# EAGLE design lab2h (EAGLE 9.6.2)
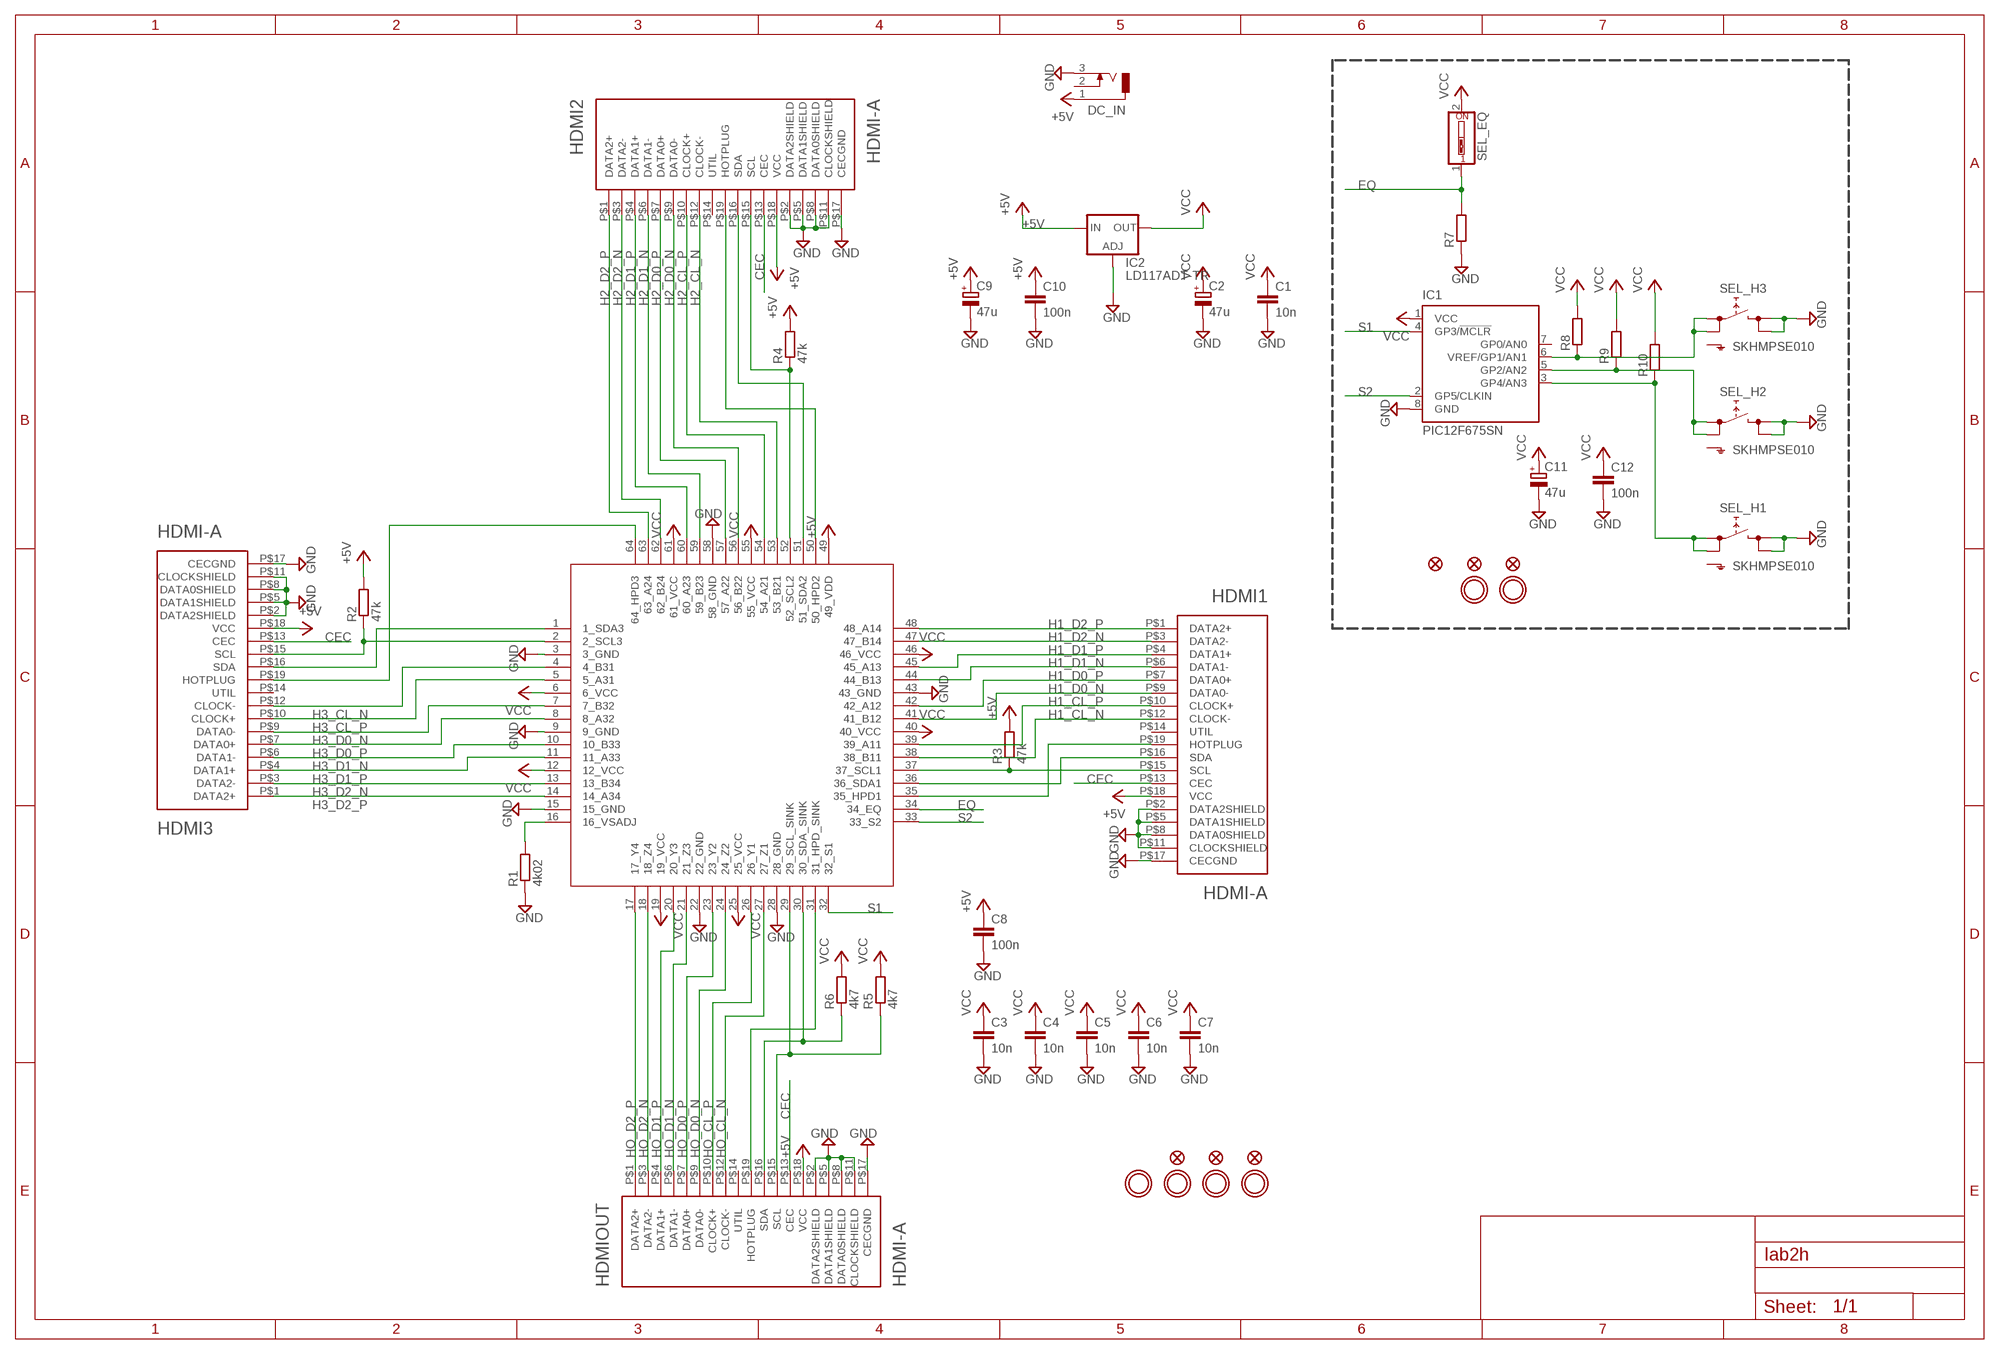
[diagram p0: schematic, sheet 1]

## Parts
C1  10n  C-EUC0402  [C0402]
C2  47u  CPOL-EUSMCA  [SMC_A]
C3  10n  C0402  [0402]
C4  10n  C0402  [0402]
C5  10n  C0402  [0402]
C6  10n  C0402  [0402]
C7  10n  C0402  [0402]
C8  100n  C0402  [0402]
C9  47u  CPOL-EUSMCA  [SMC_A]
C10  100n  C-EUC0402  [C0402]
C11  47u  CPOL-EUSMCA  [SMC_A]
C12  100n  C-EUC0402  [C0402]
DC_IN  DCJ0303  [DCJ0303]
FID1  FIDUCIAL""  [FIDUCIAL_1MM]
FID2  FIDUCIAL""  [FIDUCIAL_1MM]
FID3  FIDUCIAL""  [FIDUCIAL_1MM]
FID4  FIDUCIAL""  [FIDUCIAL_1MM]
FID5  FIDUCIAL""  [FIDUCIAL_1MM]
FID6  FIDUCIAL""  [FIDUCIAL_1MM]
HDMI1  HDMI-A  [HDMI_A]
HDMI2  HDMI-A  [HDMI_A]
HDMI3  HDMI-A  [HDMI_A]
HDMIOUT  HDMI-A  [HDMI_A]
IC1  PIC12F675SN  [SO-08]
IC2  LD117ADT-TR  [DPACK]
R1  4k02  R0402  [0402]
R2  47k  R0402  [0402]
R3  47k  R0402  [0402]
R4  47k  R0402  [0402]
R5  4k7  R0402  [0402]
R6  4k7  R0402  [0402]
R7  R-EU_R0805  [R0805]
R8  R-EU_R0805  [R0805]
R9  R-EU_R0805  [R0805]
R10  R-EU_R0805  [R0805]
SEL_EQ  SW_DIP-1  [EDG-01]
SEL_H1  SKHMPSE010  [SKHMPXE010]
SEL_H2  SKHMPSE010  [SKHMPXE010]
SEL_H3  SKHMPSE010  [SKHMPXE010]
U1  TMDS351TQFP64  [QFP50P1200X1200X120-64]
U$1  MOUNTINGHOLE3.0  [MOUNTINGHOLE_3.0_PLATED]
U$2  MOUNTINGHOLE3.0  [MOUNTINGHOLE_3.0_PLATED]
U$31  MOUNTINGHOLE3.0  [MOUNTINGHOLE_3.0_PLATED]
U$32  MOUNTINGHOLE3.0  [MOUNTINGHOLE_3.0_PLATED]
U$33  MOUNTINGHOLE3.0  [MOUNTINGHOLE_3.0_PLATED]
U$34  MOUNTINGHOLE3.0  [MOUNTINGHOLE_3.0_PLATED]

## Nets
+5V: C8.1 C9.+ C10.1 DC_IN.1 HDMI1.P$18(VCC) HDMI2.P$18(VCC) HDMI3.P$18(VCC) HDMIOUT.P$18(VCC) IC2.3(IN) R2.2 R3.2 R4.2 U1.49(49_VDD)
CEC: HDMI1.P$13(CEC) HDMI2.P$13(CEC) HDMI3.P$13(CEC) HDMIOUT.P$13(CEC)
EQ: R7.2 SEL_EQ.1 U1.34(34_EQ)
GND: C1.2 C2.- C3.2 C4.2 C5.2 C6.2 C7.2 C8.2 C9.- C10.2 C11.- C12.2 DC_IN.3 HDMI1.P$2(DATA2SHIELD) HDMI1.P$5(DATA1SHIELD) HDMI1.P$8(DATA0SHIELD) HDMI1.P$11(CLOCKSHIELD) HDMI1.P$17(CECGND) HDMI2.P$2(DATA2SHIELD) HDMI2.P$5(DATA1SHIELD) HDMI2.P$8(DATA0SHIELD) HDMI2.P$11(CLOCKSHIELD) HDMI2.P$17(CECGND) HDMI3.P$2(DATA2SHIELD) HDMI3.P$5(DATA1SHIELD) HDMI3.P$8(DATA0SHIELD) HDMI3.P$11(CLOCKSHIELD) HDMI3.P$17(CECGND) HDMIOUT.P$2(DATA2SHIELD) HDMIOUT.P$5(DATA1SHIELD) HDMIOUT.P$8(DATA0SHIELD) HDMIOUT.P$11(CLOCKSHIELD) HDMIOUT.P$17(CECGND) IC1.8(GND) IC2.1(ADJ) R1.1 R7.1 SEL_H1.3(2.1) SEL_H1.4(2.2) SEL_H2.3(2.1) SEL_H2.4(2.2) SEL_H3.3(2.1) SEL_H3.4(2.2) U1.3(3_GND) U1.9(9_GND) U1.15(15_GND) U1.22(22_GND) U1.28(28_GND) U1.43(43_GND) U1.58(58_GND)
H1_CL_N: HDMI1.P$12(CLOCK-) U1.38(38_B11)
H1_CL_P: HDMI1.P$10(CLOCK+) U1.39(39_A11)
H1_D0_N: HDMI1.P$9(DATA0-) U1.41(41_B12)
H1_D0_P: HDMI1.P$7(DATA0+) U1.42(42_A12)
H1_D1_N: HDMI1.P$6(DATA1-) U1.44(44_B13)
H1_D1_P: HDMI1.P$4(DATA1+) U1.45(45_A13)
H1_D2_N: HDMI1.P$3(DATA2-) U1.47(47_B14)
H1_D2_P: HDMI1.P$1(DATA2+) U1.48(48_A14)
H2_CL_N [100Ohm diff pair]: HDMI2.P$12(CLOCK-) U1.53(53_B21)
H2_CL_P [100Ohm diff pair]: HDMI2.P$10(CLOCK+) U1.54(54_A21)
H2_D0_N [100Ohm diff pair]: HDMI2.P$9(DATA0-) U1.56(56_B22)
H2_D0_P [100Ohm diff pair]: HDMI2.P$7(DATA0+) U1.57(57_A22)
H2_D1_N [100Ohm diff pair]: HDMI2.P$6(DATA1-) U1.59(59_B23)
H2_D1_P [100Ohm diff pair]: HDMI2.P$4(DATA1+) U1.60(60_A23)
H2_D2_N [100Ohm diff pair]: HDMI2.P$3(DATA2-) U1.62(62_B24)
H2_D2_P [100Ohm diff pair]: HDMI2.P$1(DATA2+) U1.63(63_A24)
H3_CL_N: HDMI3.P$12(CLOCK-) U1.4(4_B31)
H3_CL_P: HDMI3.P$10(CLOCK+) U1.5(5_A31)
H3_D0_N: HDMI3.P$9(DATA0-) U1.7(7_B32)
H3_D0_P: HDMI3.P$7(DATA0+) U1.8(8_A32)
H3_D1_N: HDMI3.P$6(DATA1-) U1.10(10_B33)
H3_D1_P: HDMI3.P$4(DATA1+) U1.11(11_A33)
H3_D2_N: HDMI3.P$3(DATA2-) U1.13(13_B34)
H3_D2_P: HDMI3.P$1(DATA2+) U1.14(14_A34)
HO_CL_N: HDMIOUT.P$12(CLOCK-) U1.27(27_Z1)
HO_CL_P: HDMIOUT.P$10(CLOCK+) U1.26(26_Y1)
HO_D0_N: HDMIOUT.P$9(DATA0-) U1.24(24_Z2)
HO_D0_P: HDMIOUT.P$7(DATA0+) U1.23(23_Y2)
HO_D1_N: HDMIOUT.P$6(DATA1-) U1.21(21_Z3)
HO_D1_P: HDMIOUT.P$4(DATA1+) U1.20(20_Y3)
HO_D2_N: HDMIOUT.P$3(DATA2-) U1.18(18_Z4)
HO_D2_P: HDMIOUT.P$1(DATA2+) U1.17(17_Y4)
N$25: HDMI3.P$19(HOTPLUG) U1.64(64_HPD3)
N$26: HDMI2.P$19(HOTPLUG) U1.50(50_HPD2)
N$27: HDMI1.P$19(HOTPLUG) U1.35(35_HPD1)
N$36: HDMIOUT.P$19(HOTPLUG) U1.31(31_HPD_SINK)
N$37: HDMI3.P$16(SDA) U1.1(1_SDA3)
N$38: HDMI3.P$15(SCL) R2.1 U1.2(2_SCL3)
N$39: HDMI2.P$16(SDA) U1.51(51_SDA2)
N$40: HDMI2.P$15(SCL) R4.1 U1.52(52_SCL2)
N$41: HDMI1.P$15(SCL) R3.1 U1.37(37_SCL1)
N$42: HDMI1.P$16(SDA) U1.36(36_SDA1)
N$43: HDMIOUT.P$16(SDA) R6.1 U1.30(30_SDA_SINK)
N$44: HDMIOUT.P$15(SCL) R5.1 U1.29(29_SCL_SINK)
N$45: R1.2 U1.16(16_VSADJ)
N$50: IC1.6(VREF/GP1/AN1) R8.1 SEL_H3.1(1.1) SEL_H3.2(1.2)
N$51: IC1.5(GP2/AN2) R9.1 SEL_H2.1(1.1) SEL_H2.2(1.2)
N$52: IC1.3(GP4/AN3) R10.1 SEL_H1.1(1.1) SEL_H1.2(1.2)
S1: IC1.4(GP3/!MCLR) U1.32(32_S1)
S2: IC1.2(GP5/CLKIN) U1.33(33_S2)
VCC: C1.1 C2.+ C3.1 C4.1 C5.1 C6.1 C7.1 C11.+ C12.1 IC1.1(VCC) IC2.4(OUT) R5.2 R6.2 R8.2 R9.2 R10.2 SEL_EQ.2 U1.6(6_VCC) U1.12(12_VCC) U1.19(19_VCC) U1.25(25_VCC) U1.40(40_VCC) U1.46(46_VCC) U1.55(55_VCC) U1.61(61_VCC)
Unconnected: DC_IN.2 HDMI1.P$14(UTIL) HDMI2.P$14(UTIL) HDMI3.P$14(UTIL) HDMIOUT.P$14(UTIL) IC1.7(GP0/AN0) SEL_H1.5(SH) SEL_H2.5(SH) SEL_H3.5(SH)

## Library data of the parts
C1 C10 C12 = rcl:C-EU: CAPACITOR, European symbol; SPICEPREFIX: C
C2 C9 C11 = rcl:CPOL-EU: POLARIZED CAPACITOR, European symbol; SPICEPREFIX: C
C3-C8 = labHDE_rev3:C0402
DC_IN = con-jack:DCJ0303: DC POWER JACK Source: DCJ0303.pdf; OC_FARNELL: unknown; OC_NEWARK: unknown
FID1-FID6 = microbuilder:FIDUCIAL: Fiducial Alignment Points Various fiducial points for machine vision alignment.; BOM: EXCLUDE
HDMI1-HDMI3 HDMIOUT = labHDE_rev3:HDMI-A: Horizonal HDMI type "A" jack
IC1 = microchip:PIC12F675: 8-Pin FLASH-Based 8-Bit CMOS Microcontroller Precision Internal 4 MHz oscillator factory calibrated to ±1% Low Power Features: Standby Current: - 1 nA @ 2.0V, typical Operating Current: - 8.5µA @ 32 kHz, 2.0V, typical - 100µA @ 1 MHz, 2.0V, typical Watchdog Timer Current: - 300 nA @ 2.0V, typical Timer1 oscillator current: - 4µA @ 32 kHz, 2.0V, typical Analog-to-Digital Converter module: - 10-bit resolution - Programmable 4-channel input - Voltage reference input Source: http://www.microchip.com .. 41190E.pdf; MF: MICROCHIP; MPN: PIC12F675-E/SN; OC_FARNELL: 9759026; OC_NEWARK: 92C4341
IC2 = v-reg:LD117A?*: Low drop fixed and adjustable positive voltage regulators 1 A Source: http://www.st.com/stonline/products/literature/ds/7194/ld1117axx.pdf
R1-R6 = labHDE_rev3:R0402
R7-R10 = rcl:R-EU_: RESISTOR, European symbol; SPICEPREFIX: R
SEL_EQ = special:SW_DIP-1: DIP SWITCH
SEL_H1-SEL_H3 = switch:SKHMP*E010: 6.2 X 6.5mm TACT Switch (SMD) Source: http://www3.alps.co.jp/WebObjects/catalog.woa/PDF/E/Switch/Tact/SKHM/SKHM.PDF
U1 = labHDE_rev3:TMDS351
U$1 U$2 U$31-U$34 = microbuilder:MOUNTINGHOLE: Mounting Hole For #2 screws (0.086"/2.18mm width, 0.094"/2.4mm hole) use 2.5mm; BOM: EXCLUDE

## Net classes
1 100Ohm diff pair: width 0.257 mm, clearance 0.15 mm

## Board
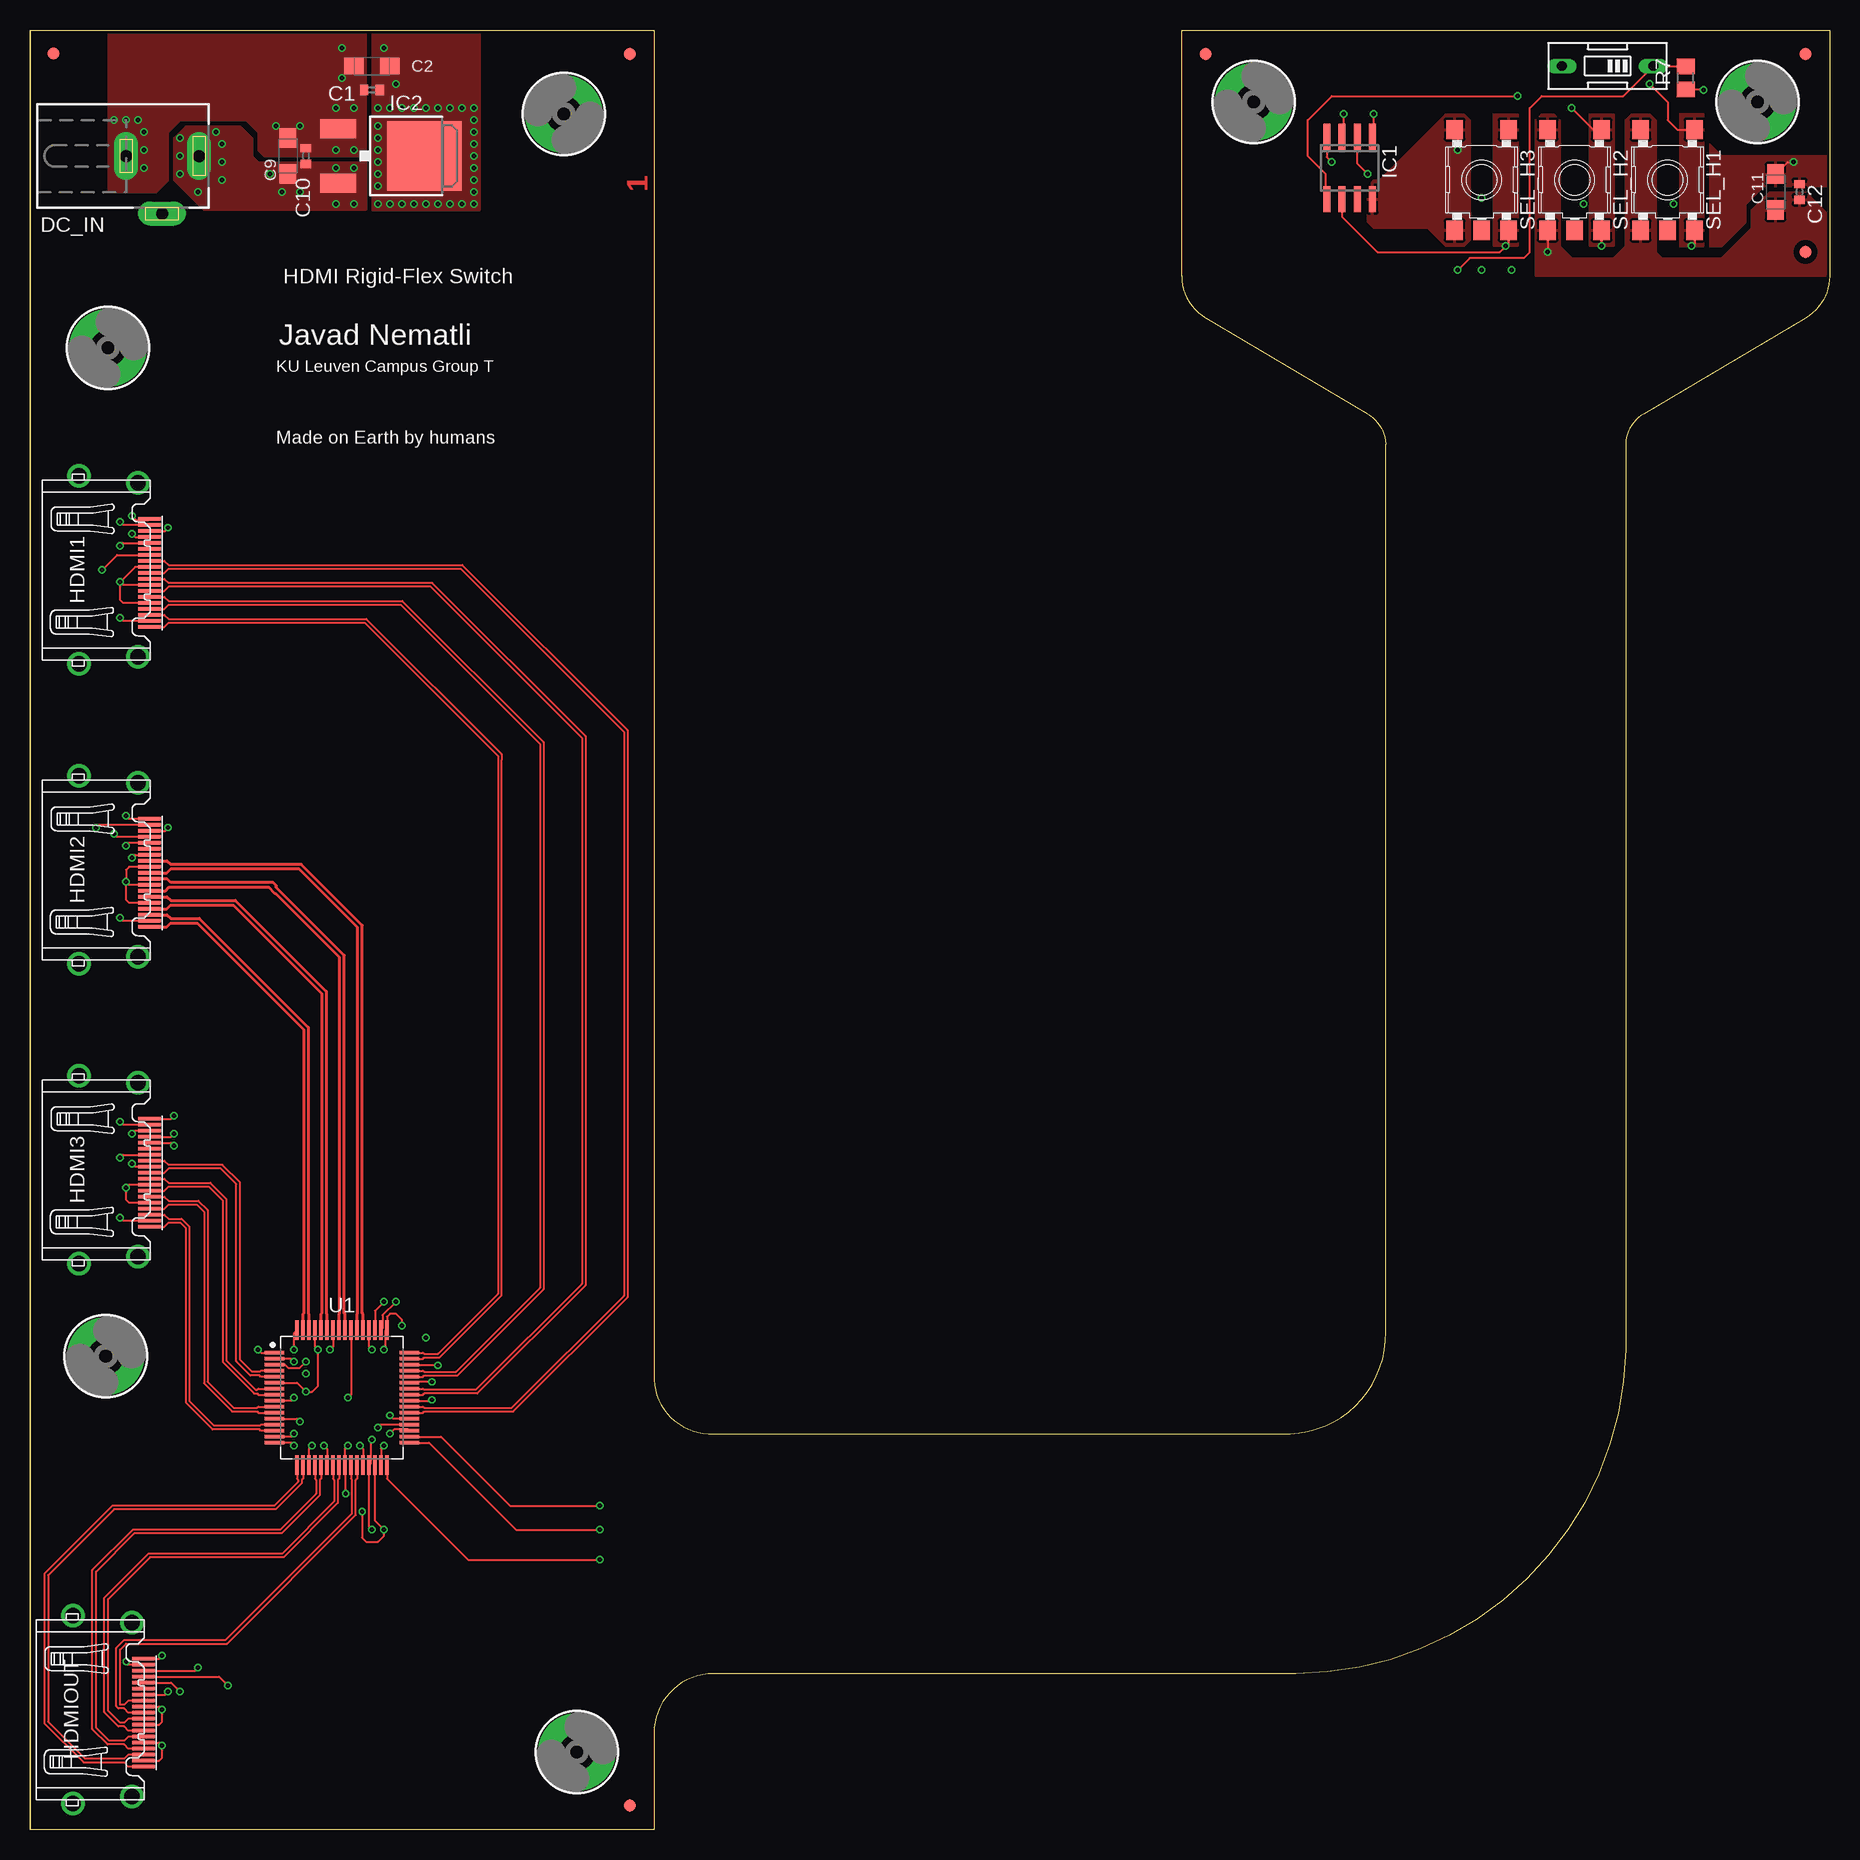
[diagram p1: board, top side]
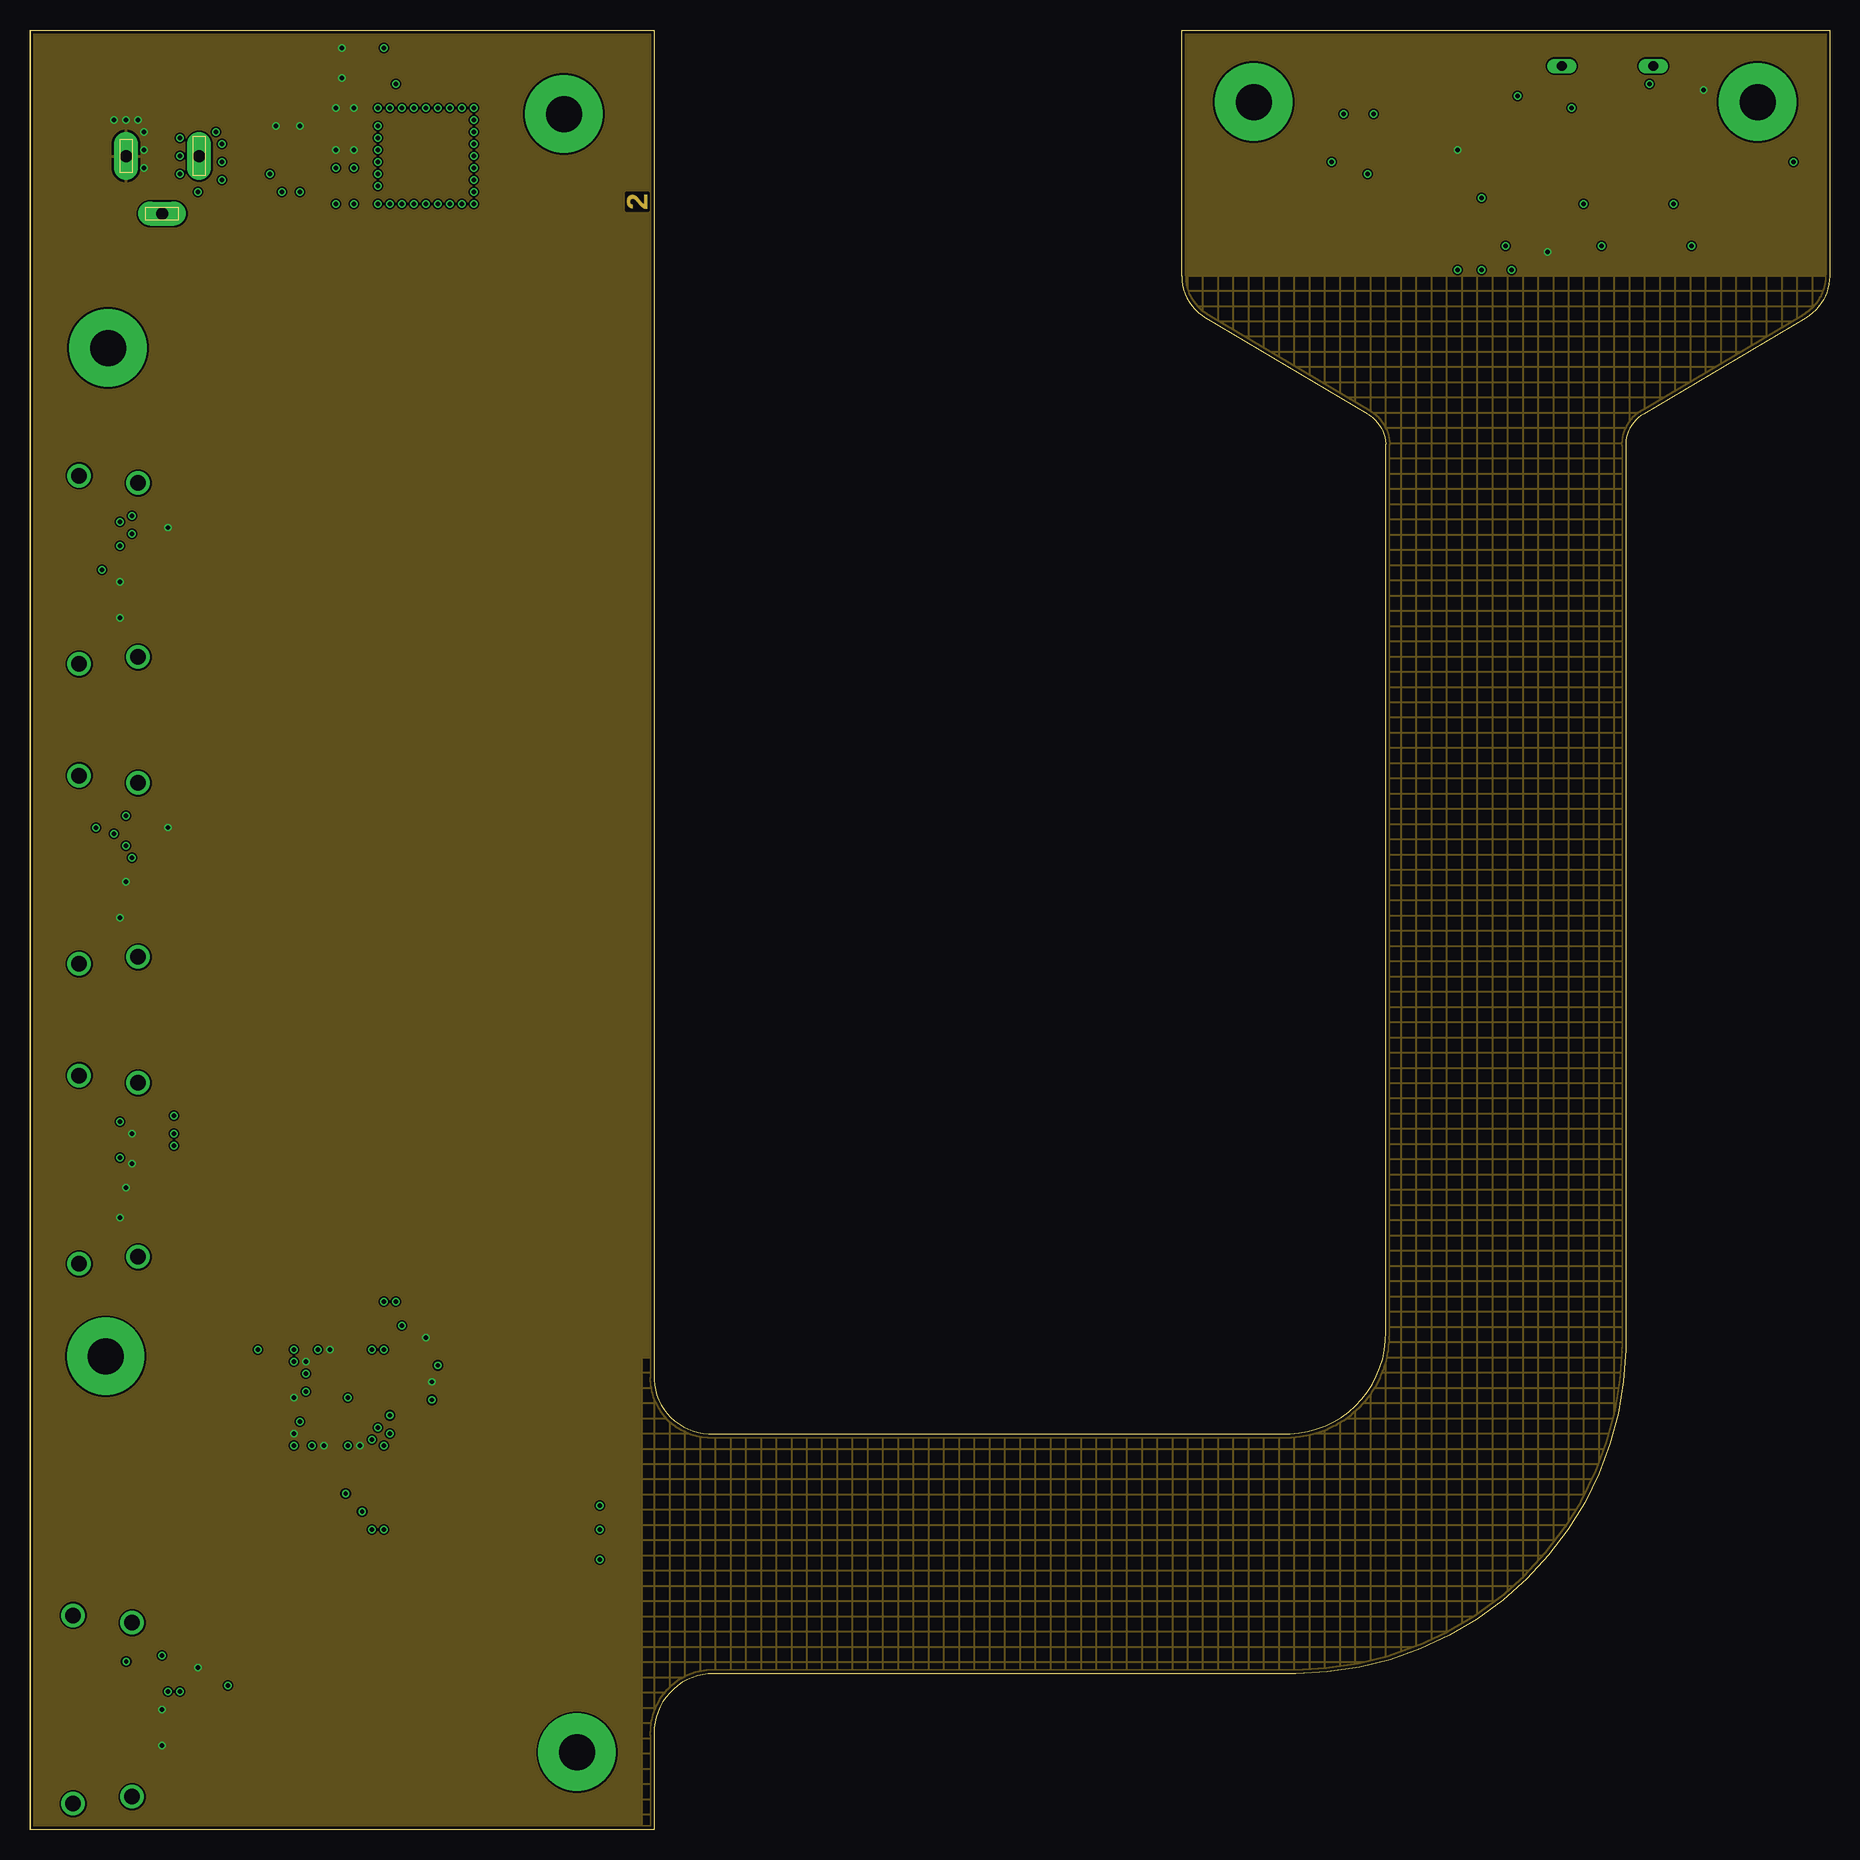
[diagram p2: board, inner layer Flex1]
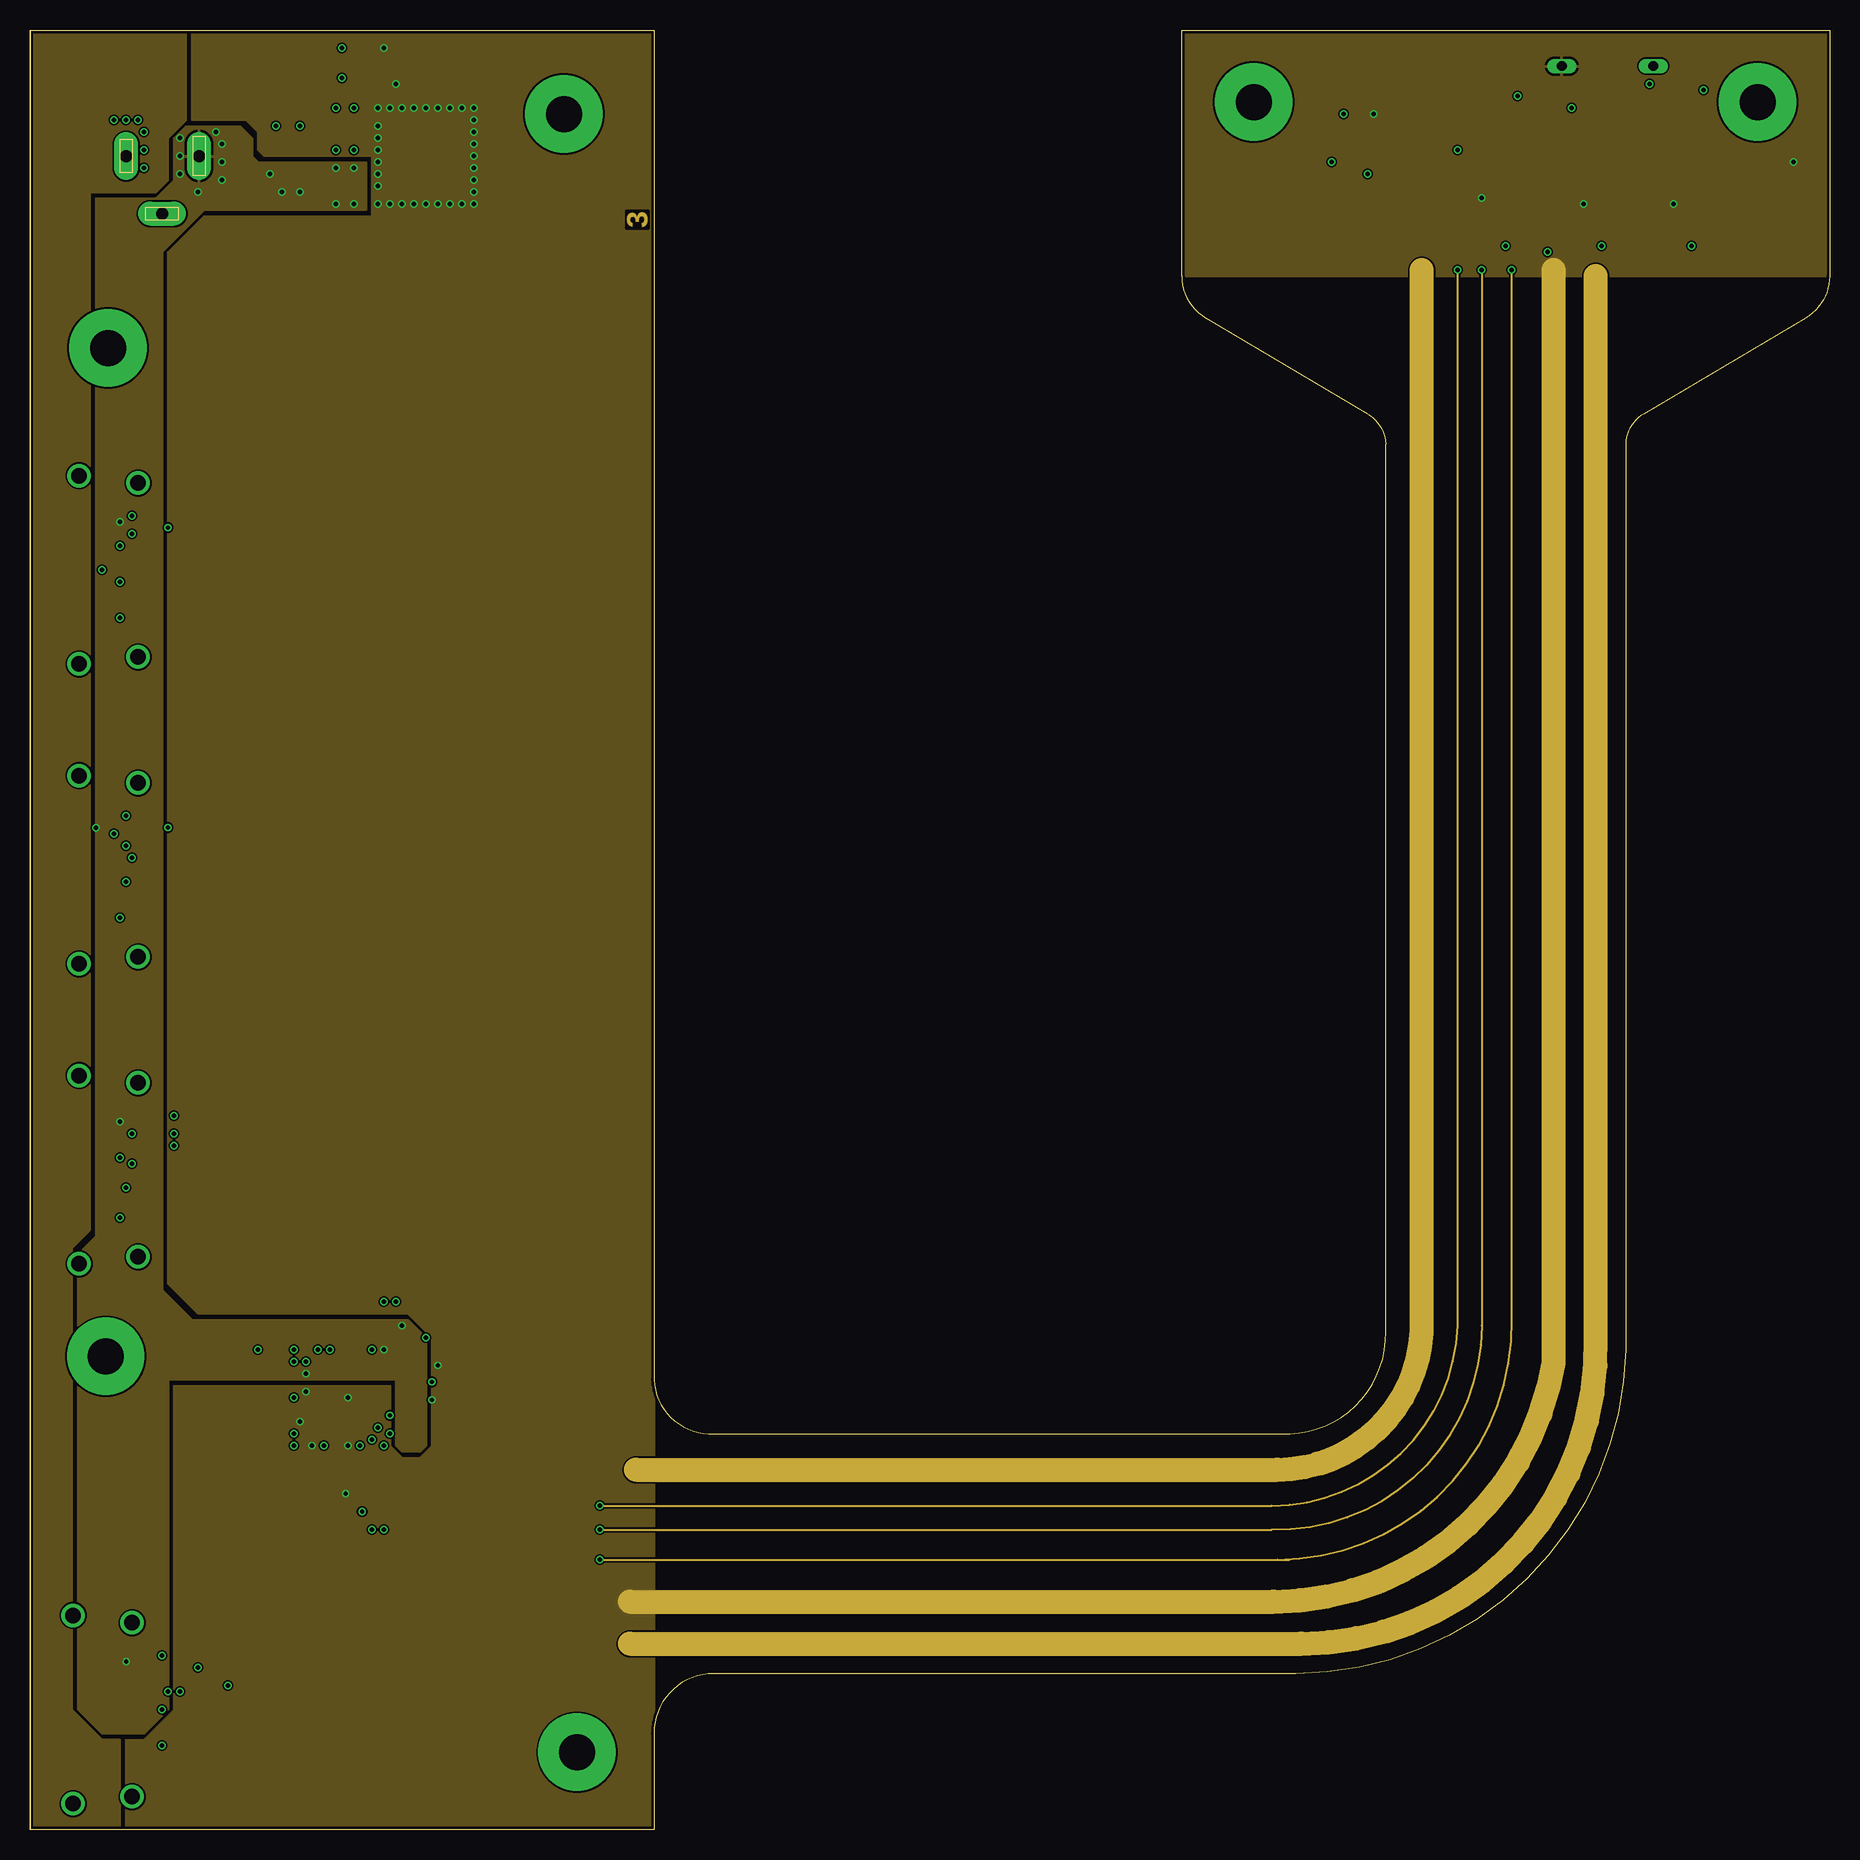
[diagram p3: board, inner layer Flex2]
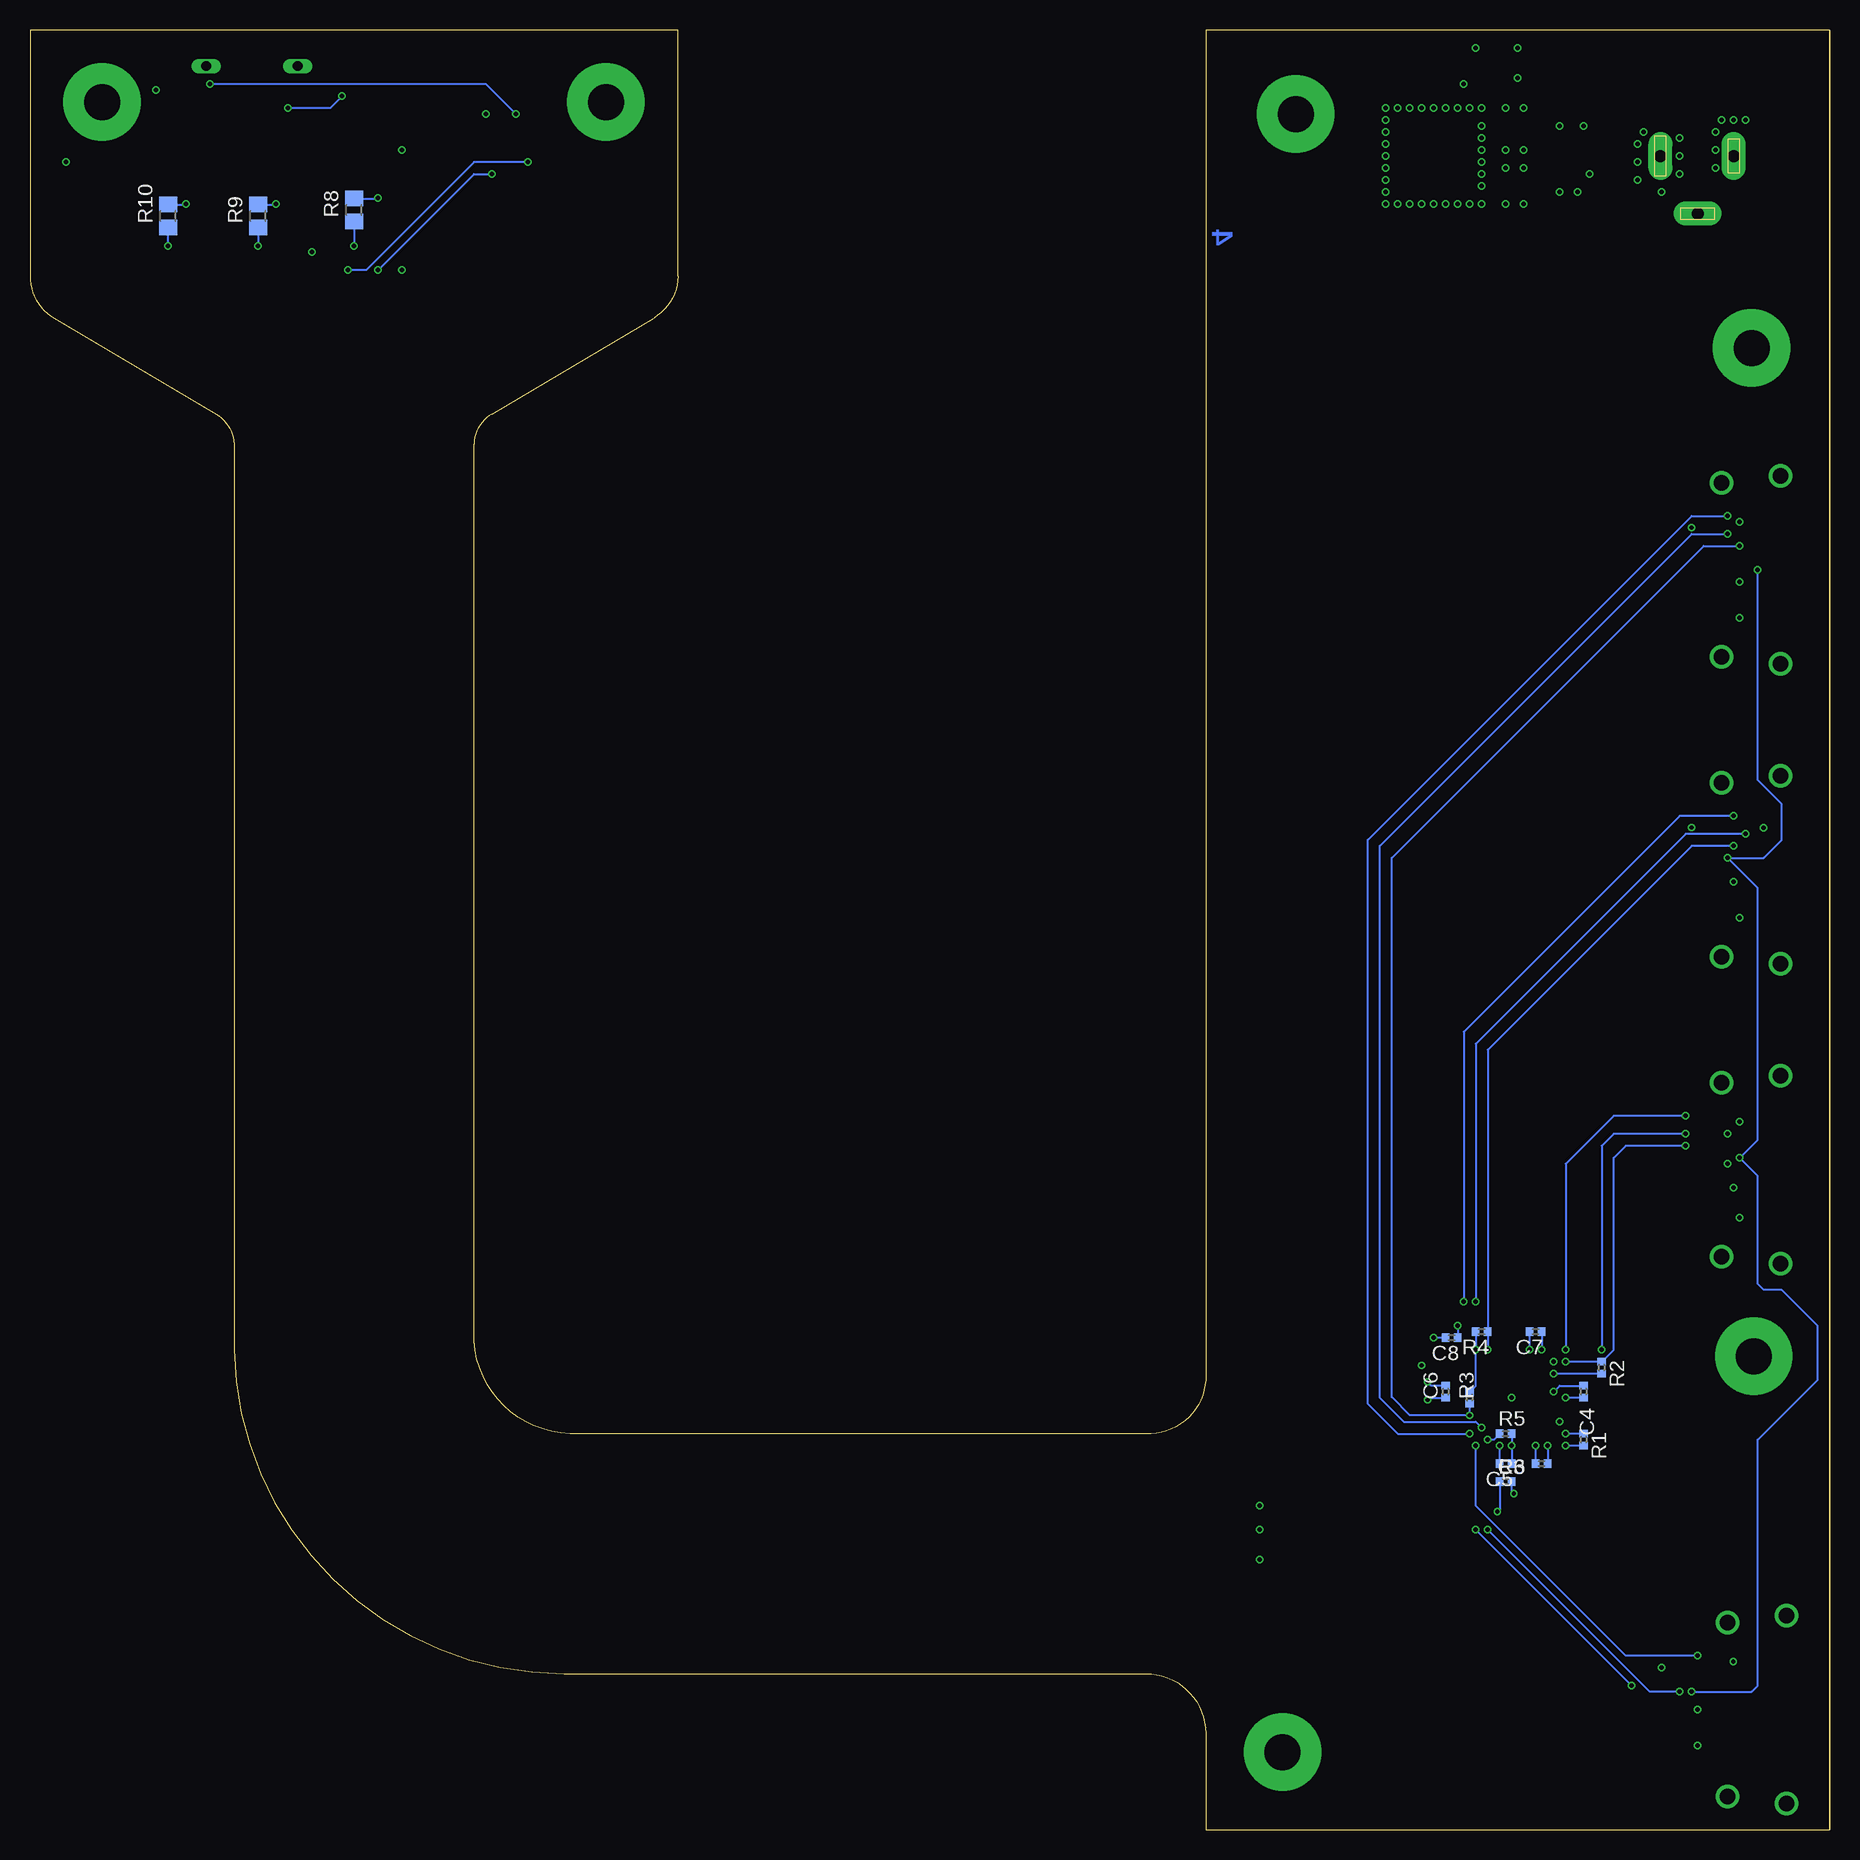
[diagram p4: board, bottom side, seen from below]

Size 150 x 150 mm. Coordinates in mm from the lower left corner, seen from the top.
Outline: 0,0 0,150 52,150 52,37.5 arc90 57,33 105,33 arc90 113,41.5 113,115.5 arc57 111.5,118 98,126 arc-59 96,129.5 96,150 150,150 150,129.5 arc-60 148,126 134.5,118 arc57 133,115.5 133,40 arc-89 105.5,13 57,13 arc90 52,8 52,0 0,0
Copper layers (1+2*15+16): Top 0.03mm / dielectric 0.285mm / Flex1 0.017mm / dielectric 0.05mm / Flex2 0.017mm / dielectric 0.285mm / Bottom 0.03mm
Design rules "4Layer_PClass6 *": minimum track width 0.15mm, minimum drill 0.35mm, track to track 0.15mm, track to pad 0.15mm, pad to pad 0.15mm, via to via 0.15mm, smd to smd 0mil, copper to edge 0.25mm, drill to drill 0.35mm, minimum pad ring 0.175mm, minimum via ring 0.125mm, stop-mask expansion 0mil, vias tented up to drill 0.45mm, thermal gap 0.2mm
Milling: 1 lines

### Footprints (pad centres in the part's own frame; a part is rotated, then mirrored left to right if it is on the bottom)
C0402 = smd 0.7 x 0.9: 1 -0.65,0; 2 0.65,0
SMC_A = smd 1.6 x 1.4: + -1.5,0; - 1.5,0
0402 = smd 0.6 x 0.7: 1 -0.5,0; 2 0.5,0
DCJ0303 = drill 1 pad 2 long: 1 0,3.1; 2 4.8,0; 3 0,-3
FIDUCIAL_1MM = smd 1 x 1: 1 0,0
HDMI_A = smd 0.3 x 1.9: P$1 4.75,3.95; P$2 4.25,3.95; P$3 3.75,3.95; P$4 3.25,3.95; P$5 2.75,3.95; P$6 2.25,3.95; P$7 1.75,3.95; P$8 1.25,3.95; P$9 0.75,3.95; P$10 0.25,3.95; P$11 -0.25,3.95; P$12 -0.75,3.95; P$13 -1.25,3.95; P$14 -1.75,3.95; P$15 -2.25,3.95; P$16 -2.75,3.95; P$17 -3.25,3.95; P$18 -3.75,3.95; P$19 -4.25,3.95 | drill 1.3: P$20 -7.25,3; P$21 7.25,3; P$22 7.85,-1.9; P$23 -7.85,-1.9
SO-08 = smd 0.6 x 2.2: 1 -1.905,-2.6; 2 -0.635,-2.6; 3 0.635,-2.6; 4 1.905,-2.6; 5 1.905,2.6; 6 0.635,2.6; 7 -0.635,2.6; 8 -1.905,2.6
DPACK = smd 1.6 x 3: 1 -2.28,-4.8; 3 2.28,-4.8 | smd 5.8 x 6.2: 4 0,2.38
R0805 = smd 1.3 x 1.5: 1 -0.95,0; 2 0.95,0
EDG-01 = drill 0.813 long: 1 0,-3.81; 2 0,3.81
SKHMPXE010 = smd 1.6 x 1.4: 1 -4.2,2.25; 2 4.2,2.25; 3 -4.2,-2.25; 4 4.2,-2.25; 5 4.2,0
QFP50P1200X1200X120-64 = smd 1.652 x 0.28: 1 -5.632,3.75; 2 -5.632,3.25; 3 -5.632,2.75; 4 -5.632,2.25; 5 -5.632,1.75; 6 -5.632,1.25; 7 -5.632,0.75; 8 -5.632,0.25; 9 -5.632,-0.25; 10 -5.632,-0.75; 11 -5.632,-1.25; 12 -5.632,-1.75; 13 -5.632,-2.25; 14 -5.632,-2.75; 15 -5.632,-3.25; 16 -5.632,-3.75; 33 5.632,-3.75; 34 5.632,-3.25; 35 5.632,-2.75; 36 5.632,-2.25; 37 5.632,-1.75; 38 5.632,-1.25; 39 5.632,-0.75; 40 5.632,-0.25; 41 5.632,0.25; 42 5.632,0.75; 43 5.632,1.25; 44 5.632,1.75; 45 5.632,2.25; 46 5.632,2.75; 47 5.632,3.25; 48 5.632,3.75 | smd 0.28 x 1.652: 17 -3.75,-5.632; 18 -3.25,-5.632; 19 -2.75,-5.632; 20 -2.25,-5.632; 21 -1.75,-5.632; 22 -1.25,-5.632; 23 -0.75,-5.632; 24 -0.25,-5.632; 25 0.25,-5.632; 26 0.75,-5.632; 27 1.25,-5.632; 28 1.75,-5.632; 29 2.25,-5.632; 30 2.75,-5.632; 31 3.25,-5.632; 32 3.75,-5.632; 49 3.75,5.632; 50 3.25,5.632; 51 2.75,5.632; 52 2.25,5.632; 53 1.75,5.632; 54 1.25,5.632; 55 0.75,5.632; 56 0.25,5.632; 57 -0.25,5.632; 58 -0.75,5.632; 59 -1.25,5.632; 60 -1.75,5.632; 61 -2.25,5.632; 62 -2.75,5.632; 63 -3.25,5.632; 64 -3.75,5.632
MOUNTINGHOLE_3.0_PLATED = drill 3 pad 6.452: P$1 0,0

### Placement (x,y rotation side)
C1  28.5,145 180 top
C2  28.5,147 180 top
C3  24,30.5 180 bottom
C4  20.5,36.5 270 bottom
C5  27,30.5 180 bottom
C6  32,36.5 90 bottom
C7  24.5,41.5 180 bottom
C8  31.5,41 180 bottom
C9  21.5,139.5 90 top
C10  23,139.5 90 top
C11  145.5,136.5 270 top
C12  147.5,136.5 270 top
DC_IN  11,139.5 270 top
FID1  1.94,148.04 0 top
FID2  50,2 0 top
FID3  50,148 0 top
FID4  98,148 0 top
FID5  148,148 0 top
FID6  148,131.5 0 top
HDMI1  6,105 270 top
HDMI2  6,80 270 top
HDMI3  6,55 270 top
HDMIOUT  5.5,10 270 top
IC1  110,138.5 180 top
IC2  30.5,139.5 270 top
R1  20.5,32.5 270 bottom
R2  19,38.5 270 bottom
R3  30,36 90 bottom
R4  29,41.5 180 bottom
R5  27,33 0 bottom
R6  27,29 0 bottom
R7  138,146 90 top
R8  123,135 90 bottom
R9  131,134.5 90 bottom
R10  138.5,134.5 90 bottom
SEL_EQ  131.5,147 90 top
SEL_H1  136.5,137.5 270 top
SEL_H2  128.75,137.5 270 top
SEL_H3  121,137.5 270 top
U1  26,36 0 top
U$1  144,144 0 top
U$2  45.59,6.45 0 top
U$31  102,144 0 top
U$32  6.31,39.45 0 top
U$33  6.5,123.5 0 top
U$34  44.5,143 90 top

### Tracks (layer width: path | path; a pad name or v marks a point on that pad's centre or on a via)
+5V  (via drill 0.35)
  Top 0.15: 29.62,41.57 29.62,41.5
  Top 0.152: v29.5,40 29.62,40.12 29.62,41.5 U1.49 29.75,42.75 30,43 30.5,43 31,42.5 v31,42 | HDMI1.P$18 7.75,108.75 v7.5,109 | HDMI2.P$18 5.75,83.75 v5.5,83.5 | HDMI3.P$18 7.75,58.75 v7.5,59 | HDMIOUT.P$18 8.05,13.75 7.91,13.89 v8.03,14
  Bottom 0.15: v31,42 C8.1
  Bottom 0.152: R4.2 v29.5,40 29.5,37 R3.2 | R2.2 v23,38
  other vias: 25.5,135.5 27,135.5 27,138.5 20,138 16,137.5 25.5,138.5 21,136.5 22.5,136.5 16,139 16,140.5 12.5,138 12.5,139.5 12.5,141 14,136.5 15.5,141.5
  pour Top (no thermals): 21.5,139 28,139 28,135 14.5,135 12,137.5 12,141 13,142 17.5,142 18.5,141 18.5,139.5 19,139
  pour Flex2: 12,137.5 12,141 13,142 17.5,142 18.5,141 18.5,139.5 19,139 28,139 28,135 14.5,135 11,131.5 11,45 13.5,42.5 31.5,42.5 33,41 33,32 32.5,31.5 31,31.5 30.5,32 30.5,37.5 11.5,37.5 11.5,10 9.5,8 6,8 4,10 4,48 5.5,49.5 5.5,136 10.5,136
CEC  (via drill 0.35)
  Top 0.15: HDMIOUT.P$13 11.25,11.25 v11.5,11.5 | v7.5,56 7.75,56.25 HDMI3.P$13 | v8.5,81 8.75,81.25 HDMI2.P$13
  Top 0.152: v6,105 7.25,106.25 HDMI1.P$13
  Bottom 0.15: v11.5,11.5 6.5,11.5 6,12 6,32.5 1,37.5 1,42 4,45 5.5,45 6,45.5 6,54.5 v7.5,56 6,57.5 6,78.5 v8.5,81
  Bottom 0.152: v8.5,81 5.5,81 4,82.5 4,85.5 6,87.5 v6,105
EQ  (via drill 0.35)
  Top 0.152: U1.34 34.25,32.75 40,27 v47.5,27 | v119,130 120,131 124.5,131 125,131.5 125,143.5 126,144.5 132.81,144.5 SEL_EQ.1 137.95,147 R7.2
  Flex2 0.152: v47.5,27 103.5,27 arc88 119,42 v119,130
GND  (via drill 0.35)
  Top 0.152: HDMIOUT.P$17 13.75,13.25 v14,13.5 | HDMI3.P$17 8.75,58.25 v8.5,58 | HDMI2.P$17 11.25,83.25 11.5,83.5 v11.5,83.53 | HDMI1.P$17 11.25,108.25 11.5,108.5 v11.5,108.53 | v22,33 21.75,32.75 U1.15 | v24.5,32 24.75,31.75 U1.22 | v27.5,32 27.75,31.75 U1.28 | v22,36 21.75,35.75 U1.9 | U1.58 25.25,40.25 v25,40 | U1.3 21.25,38.75 21.53,38.47 22.47,38.47 v23,39 | v33.5,37.32 31.7,37.32 U1.43 | SEL_H3.3 119,141.45 v119,140 | 138.05,145 R7.1 139.45,145.05 v139.5,145 | SEL_H2.4 v126.5,131.5 | HDMI3.P$11 8.75,55.25 v8.5,55.5 | HDMIOUT.P$11 10.75,10.25 v11,10 11,9 10.75,8.75 HDMIOUT.P$8 | HDMI2.P$8 8.25,78.75 v8,79 | HDMI1.P$8 7.75,103.75 v7.5,104 | HDMIOUT.P$5 10.75,7.25 v11,7 11,6 10.75,5.75 HDMIOUT.P$2 | HDMI3.P$8 8.25,53.75 v8,53.5 8,52.5 8.25,52.25 HDMI3.P$5 | HDMI3.P$2 7.75,50.75 v7.5,51 | HDMI2.P$5 8.25,77.25 8,77.5 v8,79 | HDMI2.P$2 7.75,75.75 v7.5,76 | HDMI1.P$5 7.75,102.25 7.5,102.5 v7.5,104 | HDMI1.P$2 7.75,100.75 v7.5,101 | HDMI1.P$11 8.75,105.25 v7.5,104 | HDMI2.P$11 8.25,80.25 8,80 v8,79
  Bottom 0.152: R1.1 v22,33 | C3.2 v24.5,32 | C5.2 v27.5,32 | C4.2 v22,36 | v25,40 C7.2 | C6.2 33.18,37 v33.5,37.32 | C8.2 v33,41
  other vias: 7,142.5 8,142.5 9,142.5 9.5,141.5 9.5,140 9.5,138.5 20.5,142 22.5,142 27,143.5 26,146 26,148.5 25.5,140 27,140 25.5,143.5
  pour Top (no thermals): 19.5,139.5 28,139.5 28,150 6.5,150 6.5,136.5 10.5,136.5 11.5,137.5 11.5,141.5 12.5,142.5 18,142.5 19,141.5 19,140
  pour Flex1: 0,0 51,0 51,39.5 52,39.5 52,150 0,150
  pour Flex1 (no thermals, hatched): 48.5,39.5 48.5,0 52,0 52,8 arc-90 57,13 105.5,13 arc90 133,40.5 133,115.5 arc-37 133.5,117 arc-16 134.5,118 148,126 arc59 150,129.5 150,133 96,133 96,129.5 arc28 96.5,127.5 arc34 98,126 111.5,118 arc-57 113,115.5 113,41.5 113,41 arc-90 105,33 57,33 arc-90 52,38 52,39.5
  pour Flex1 (no thermals): 96,150 150,150 150,129.5 96,129.5
  pour Top: 111.5,134 111.5,137 112,137.5 112.5,137.5 118,143 119.5,143 120,142.5 120,132.5 119.5,132 119,132 118,132 116.5,133.5 112,133.5
  pour Top: 125.5,131.5 125.5,142.5 126,143 127,143 127.5,142.5 127.5,132 128.5,131 132,131 133,132 133,142.5 133.5,143 134.5,143 135,143 135.5,142.5 135.5,131.5 136,131 141,131 143.5,133.5 143.5,135 144.5,136 145,136.5 148,136.5 150,134.5 150,129.5 125.5,129.5
H1_CL_N
  Top 0.152: U1.38 32.76,34.75 32.86,34.85 40.28,34.85 49.8,44.38 49.8,91.62 36.03,105.4 11.55,105.4 11.21,105.75 HDMI1.P$12
H1_CL_P
  Top 0.152: U1.39 32.76,35.25 32.86,35.15 40.15,35.15 49.5,44.5 49.5,91.5 35.9,105.1 11.55,105.1 11.21,104.75 HDMI1.P$10
H1_D0_N
  Top 0.152: HDMI1.P$9 11.21,104.25 11.55,103.9 33.53,103.9 46.3,91.12 46.3,45.38 37.28,36.35 32.86,36.35 32.76,36.25 U1.41
H1_D0_P
  Top 0.152: HDMI1.P$7 11.21,103.25 11.55,103.6 33.4,103.6 46,91 46,45.5 37.15,36.65 32.86,36.65 32.76,36.75 U1.42
H1_D1_N
  Top 0.152: U1.44 32.76,37.75 32.86,37.85 35.62,37.85 42.8,45.03 42.8,90.62 31.03,102.4 11.55,102.4 11.21,102.75 HDMI1.P$6
H1_D1_P
  Top 0.152: U1.45 32.76,38.25 32.86,38.15 35.5,38.15 42.5,45.15 42.5,90.5 30.9,102.1 11.55,102.1 11.21,101.75 HDMI1.P$4
H1_D2_N
  Top 0.152: HDMI1.P$3 11.21,101.25 11.55,100.9 28.03,100.9 39.3,89.62 39.3,89.12 39.3,89 39.3,44.53 34.12,39.35 32.86,39.35 32.76,39.25 U1.47
H1_D2_P
  Top 0.152: HDMI1.P$1 11.21,100.25 11.55,100.6 27.9,100.6 39,89.5 39,44.65 34,39.65 32.86,39.65 32.76,39.75 U1.48
H2_CL_N
  Top 0.257: HDMI2.P$12 11.41,80.75 11.71,80.45 22.62,80.45 27.7,75.37 27.7,43.02 27.75,42.97 U1.53
H2_CL_P
  Top 0.257: HDMI2.P$10 11.41,79.75 11.71,80.05 22.45,80.05 27.3,75.2 27.3,43.02 27.25,42.97 U1.54
H2_D0_N
  Top 0.257: U1.56 26.25,42.97 26.2,43.02 26.2,72.87 20.54,78.54 20.54,78.67 20.25,78.95 11.73,78.95 11.44,79.25 HDMI2.P$9
H2_D0_P
  Top 0.257: U1.57 25.75,42.97 25.8,43.02 25.8,72.7 20.5,78 20.44,78 19.9,78.55 11.58,78.55 11.29,78.25 HDMI2.P$7
H2_D1_N
  Top 0.257: U1.59 24.75,42.97 24.7,43.02 24.7,69.87 17.12,77.45 11.71,77.45 11.41,77.75 HDMI2.P$6
H2_D1_P
  Top 0.257: U1.60 24.25,42.97 24.3,43.02 24.3,69.7 16.95,77.05 11.71,77.05 11.41,76.75 HDMI2.P$4
H2_D2_N
  Top 0.257: HDMI2.P$3 11.41,76.25 11.71,75.95 14.12,75.95 23.2,66.87 23.2,43.02 23.25,42.97 U1.62
H2_D2_P
  Top 0.257: HDMI2.P$1 11.41,75.25 11.71,75.55 13.95,75.55 22.8,66.7 22.8,43.02 22.75,42.97 U1.63
H3_CL_N
  Top 0.152: U1.4 19.24,38.25 19.14,38.15 18.5,38.15 17.5,39.15 17.5,53.93 16.03,55.4 11.55,55.4 11.21,55.75 HDMI3.P$12
H3_CL_P
  Top 0.152: U1.5 19.24,37.75 19.14,37.85 18.38,37.85 17.2,39.03 17.2,53.8 15.9,55.1 11.55,55.1 11.21,54.75 HDMI3.P$10
H3_D0_N
  Top 0.152: HDMI3.P$9 11.21,54.25 11.55,53.9 15.03,53.9 16.37,52.56 16.37,39.09 18.81,36.65 18.93,36.65 19.03,36.75 U1.7
H3_D0_P
  Top 0.152: HDMI3.P$7 11.21,53.25 11.55,53.6 14.9,53.6 16.07,52.43 16.07,38.97 18.68,36.35 18.94,36.35 19.04,36.25 U1.8
H3_D1_N
  Top 0.152: HDMI3.P$6 11.21,52.75 11.55,52.4 14.03,52.4 14.8,51.62 14.8,37.32 16.97,35.15 18.93,35.15 19.03,35.25 U1.10
H3_D1_P
  Top 0.152: HDMI3.P$4 11.21,51.75 11.55,52.1 13.9,52.1 14.5,51.5 14.5,37.2 16.85,34.85 18.94,34.85 19.04,34.75 U1.11
H3_D2_N
  Top 0.152: HDMI3.P$3 11.21,51.25 11.55,50.9 12.62,50.9 13.3,50.22 13.3,35.7 15.35,33.65 19.14,33.65 19.24,33.75 U1.13
H3_D2_P
  Top 0.152: HDMI3.P$1 11.21,50.25 11.55,50.6 12.5,50.6 13,50.1 13,35.57 15.22,33.35 19.14,33.35 19.24,33.25 U1.14
HO_CL_N
  Top 0.152: U1.27 27.25,29.24 27.15,29.14 27.15,26.22 16.43,15.5 8,15.5 7.5,15 7.5,10.4 7.85,10.4 8.2,10.75 HDMIOUT.P$12
HO_CL_P
  Top 0.152: U1.26 26.75,29.24 26.85,29.14 26.85,26.35 16.3,15.8 7.88,15.8 7.2,15.12 7.2,10.28 7.38,10.1 7.85,10.1 8.2,9.75 HDMIOUT.P$10
HO_D0_N
  Top 0.152: U1.24 25.75,29.24 25.65,29.14 25.65,27.22 21.12,22.7 10,22.7 6.5,19.2 6.5,9.9 7.5,8.9 7.85,8.9 8.2,9.25 HDMIOUT.P$9
HO_D0_P
  Top 0.152: U1.23 25.25,29.24 25.35,29.14 25.35,27.35 21,23 9.88,23 6.2,19.32 6.2,9.78 7.38,8.6 7.85,8.6 8.2,8.25 HDMIOUT.P$7
HO_D1_N
  Top 0.152: U1.21 24.25,29.24 24.15,29.14 24.15,27.88 20.97,24.7 8.7,24.7 5.5,21.5 5.5,8.5 6.6,7.4 7.85,7.4 8.2,7.75 HDMIOUT.P$6
HO_D1_P
  Top 0.152: U1.20 23.75,29.24 23.85,29.14 23.85,28 20.85,25 8.57,25 5.2,21.62 5.2,8.38 6.47,7.1 7.85,7.1 8.2,6.75 HDMIOUT.P$4
HO_D2_N
  Top 0.152: U1.18 22.75,29.24 22.65,29.14 22.65,28.88 20.47,26.7 7,26.7 1.5,21.2 1.5,9 4.6,5.9 7.85,5.9 8.2,6.25 HDMIOUT.P$3
HO_D2_P
  Top 0.152: U1.17 22.25,29.24 22.35,29.14 22.35,29 20.35,27 6.88,27 1.2,21.32 1.2,8.88 4.47,5.6 7.85,5.6 8.2,5.25 HDMIOUT.P$1
N$1
  Flex2 2: 116,130 116,41.5 arc-87 103.95,30 50.5,30
N$2
  Flex2 2: 130.5,129.5 130.5,41 arc-92 105.96,15.5 50,15.5
N$25  (via drill 0.35)
  Top 0.152: v12,59.5 11.75,59.25 HDMI3.P$19 | v22,40 22,41.38 U1.64
  Bottom 0.152: v12,59.5 18,59.5 22,55.5 v22,40
N$26  (via drill 0.35)
  Top 0.152: HDMI2.P$19 8.25,84.25 v8,84.5 | v30.5,44 29.38,42.88 29.38,41.77 U1.50
  Bottom 0.152: v8,84.5 12.5,84.5 30.5,66.5 v30.5,44
N$27  (via drill 0.35)
  Top 0.152: v30,33 30.38,33.38 31.5,33.38 U1.35 | v8.5,109.5 8.87,109.13 9.83,109.13 HDMI1.P$19
  Bottom 0.152: v30,33 36,33 38.5,35.5 38.5,82.5 11.5,109.5 v8.5,109.5
N$36  (via drill 0.35)
  Top 0.152: HDMIOUT.P$19 10.75,14.25 v11,14.5 | v29.5,32 29.25,31.75 U1.31
  Bottom 0.152: v11,14.5 17,14.5 29.5,27 v29.5,32
N$37  (via drill 0.35)
  Top 0.152: HDMI3.P$16 11.75,57.75 v12,58 | v19,40 19.25,39.75 U1.1
  Bottom 0.152: v12,58 18,58 19,57 v19,40
N$38  (via drill 0.35)
  Top 0.152: HDMI3.P$15 11.75,57.25 v12,57 | v22,39 21.75,39.25 U1.2
  Bottom 0.152: v12,57 17,57 18,56 18,40 R2.1 v22,39
N$39  (via drill 0.35)
  Top 0.152: HDMI2.P$16 7.25,82.75 v7,83 | v29.5,44 28.75,43.25 U1.51
  Bottom 0.152: v7,83 12,83 29.5,65.5 v29.5,44
N$40  (via drill 0.35)
  Top 0.152: HDMI2.P$15 8.25,82.25 v8,82 | v28.5,40 28.25,40.25 U1.52
  Bottom 0.152: v8,82 11.5,82 28.5,65 R4.1 v28.5,40
N$41  (via drill 0.35)
  Top 0.152: U1.37 30.25,34.25 30,34.5 v30,34.53 | v7.5,107 7.75,107.25 HDMI1.P$15
  Bottom 0.152: v7.5,107 10.5,107 36.5,81 36.5,36.05 34.97,34.53 v30,34.53 R3.1
N$42  (via drill 0.35)
  Top 0.152: U1.36 29.25,33.75 v29,33.5 | v8.5,108 8.75,107.75 HDMI1.P$16
  Bottom 0.152: v8.5,108 11.5,108 37.5,82 37.5,36 35.5,34 29.5,34 v29,33.5
N$43  (via drill 0.35)
  Top 0.152: HDMIOUT.P$16 15.75,12.75 v16.5,12 | U1.30 28.75,25.75 v29.5,25 29.5,24.5 29,24 28,24 27.68,24.32 v27.68,26.5
  Bottom 0.152: R6.1 27.5,26.68 v27.68,26.5 | v16.5,12 v29.5,25
N$44  (via drill 0.35)
  Top 0.152: HDMIOUT.P$15 11.75,12.25 v12.5,11.5 | v28.5,25 28.25,25.25 U1.29 28.38,30.5 28.38,32.29 28.5,32.4 v28.5,32.5
  Bottom 0.152: v28.5,25 15,11.5 v12.5,11.5 | R5.1 28,32.5 v28.5,32.5
N$45  (via drill 0.35)
  Top 0.152: U1.16 21.87,32.25 22,32.12 v22,32
  Bottom 0.152: R1.2 v22,32
N$50  (via drill 0.35)
  Top 0.152: SEL_H3.2 123.25,132.25 v123,132 122.5,131.5 112.31,131.5 109.36,134.45 IC1.6
  Bottom 0.152: R8.1 v123,132
  pour Top: 124,132 122,132 122,143 124,143
N$51  (via drill 0.35)
  Top 0.152: v131,132 SEL_H2.2 | IC1.5 108,136 108,138 106.5,139.5 106.5,142.5 108.5,144.5 v124,144.5 | v128.5,143.5 130.3,141.7 SEL_H2.1
  Bottom 0.152: R9.1 v131,132 | v128.5,143.5 125,143.5 v124,144.5
  pour Top: 130,132.5 130,143 132,143 132,132 130,132
N$52  (via drill 0.35)
  Top 0.152: SEL_H1.2 138.75,132.25 v138.5,132 | IC1.3 109.5,141.24 v109.5,143 | v135,145.5 136.5,144 136.5,142.5 137.3,141.7 SEL_H1.1
  Bottom 0.152: v138.5,132 R10.1 | v135,145.5 112,145.5 v109.5,143
  pour Top: 137.5,132 139.5,132 139.5,143 137.5,143
S1  (via drill 0.35)
  Top 0.152: U1.32 29.75,29.25 36.5,22.5 v47.5,22.5 | IC1.4 108.09,139.41 v108.5,139
  Flex2 0.152: v123.5,130 123.5,42.5 arc-91 104,22.5 | 104,22.5 104.99,22.5 | v47.5,22.5 104,22.5
  Bottom 0.152: v108.5,139 113,139 122,130 v123.5,130
S2  (via drill 0.35)
  Top 0.152: U1.33 33.25,32.25 40.5,25 v47.5,25 | v111.5,138 110.64,138.87 IC1.2
  Flex2 0.152: v47.5,25 103.5,25 arc92 121,42 v121,130
  Bottom 0.152: v121,130 113,138 v111.5,138
VCC  (via drill 0.35)
  Top 0.152: U1.19 23.25,31.75 v23.5,32 | v26.5,32 26.25,31.75 U1.25 26.25,28.07 v26.32,28 | U1.6 22.25,37.25 v23,36.5 23.5,36.5 24,37 v24,40 23.75,40.25 U1.61 | U1.46 33.93,38.75 v34,38.68 | U1.40 33.43,35.75 v33.5,35.82 | U1.55 26.75,36.25 v26.5,36 | IC1.1 112,141.19 v112,143 | C11.+ 146.5,139 v147,139 | U1.12 22.25,34.25 v22.5,34
  Flex2 2: 127,130 127,39 arc-81 103.67,19 50,19
  Bottom 0.152: v23.5,32 C3.1 | C5.1 v26.5,32 R5.2 | v23,36.5 22.5,37 C4.1 | C7.1 v24,40 | v33.5,35.82 33.32,36 C6.1 | R8.2 121.05,135.95 v121,136 | R9.2 129.55,135.45 v129.5,135.5 | R10.2 137.05,135.45 v137,135.5 | v26.32,28 26.5,28.18 R6.2
  other vias: 29,135.5 29,143.5 30,143.5 31,143.5 32,143.5 33,143.5 34,143.5 29,139 29,140 29,141 29,142 29,138 29,137 30,135.5 31,135.5 32,135.5 33,135.5 34,135.5 35,135.5 37,135.5 36,135.5 37,136.5 37,137.5 37,138.5 37,139.5 37,140.5 37,141.5 37,142.5 37,143.5 36,143.5 35,143.5 30.5,145.5 29.5,148.5
  pour Top (no thermals): 28.5,150 28.5,135 37.5,135 37.5,150
  pour Flex2 (no thermals): 5.5,136.5 10.5,136.5 11.5,137.5 11.5,141 13,142.5 13,150 0,150 0,0 7.5,0 7.5,7.5 6,7.5 3.5,10 3.5,48.5 5,50 5,136.5
  pour Flex2 (no thermals): 8,0 8,7.5 9.5,7.5 12,10 12,37 30,37 30,32 31,31 32.5,31 33.5,32 33.5,41 31.5,43 14,43 11.5,45.5 11.5,131.5 14.5,134.5 28.5,134.5 28.5,139.5 19.5,139.5 19,140 19,141.5 18,142.5 13.5,142.5 13.5,150 52,150 52,0
  pour Flex2: 96,129.5 150,129.5 150,150 96,150
  pour Top: 140,140.5 140,132 141,132 143,134 143,135.5 144.5,137 150,137 150,139.5 141.5,139.5 141,139.5

### Text on the board
Top: 1 | Top
Flex1: 2 | Flex1
Flex2: 3 | Flex2
Bottom: 4 | Bottom
tPlace: HDMI Rigid-Flex Switch | Javad Nematli | KU Leuven Campus Group T | Made on Earth by humans
Document: 1Ri-2F-1Ri 0.744mm Rigid-Flex WE Build | 15um Soldermask IPC-SM840 -> Epsilon_r 3.5 | Layer 1 - HS Digital -> 30um (1/4 oz) copper | 105um Prepreg IPC-4101/127/128 -> Epsilon_r 3.8 / 180um Prepreg IPC-4101/127/128 -> Epsilon_r 3.9 | Layer 2 - HS GND + Flex Signal -> 17um ED Base Copper | 50um Flexible Core IPC-4204/11 -> Epsilon_r 3.4 | Layer 15 - Power -> 17um ED Base Copper | 180um Prepreg IPC-4101/127/128 -> Epsilon_r 3.9 / 105um Prepreg IPC-4101/127/128 -> Epsilon_r 3.8 | Layer 16 - Signal -> 30um (1/4 oz) copper | 15um Soldermask IPC-SM840 -> Epsilon_r 3.5 | Surface Edge-Coupled Stripline Impedance Control: / / 100 Ohm Differential - 257um (width), 150um (space) | Rigid outline layer - 113 / Flex outline layer - 114